# Altium project SIM_V2.PrjPCB
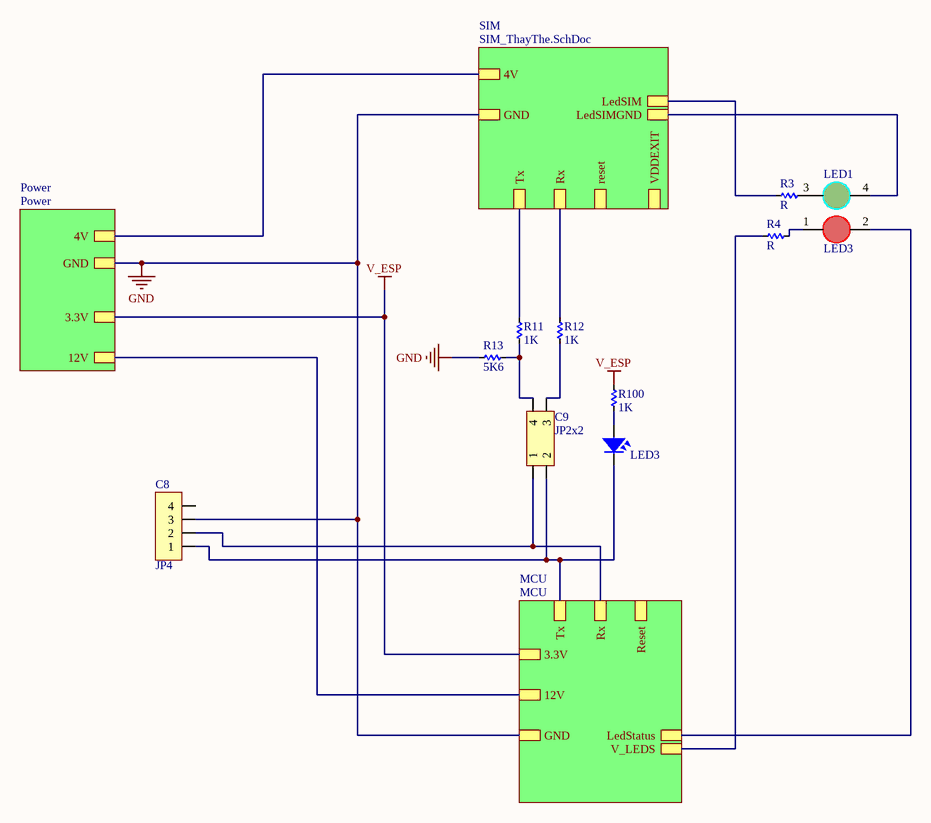
[diagram p0: Sheet1.SchDoc]
4 sheets, 64 parts. Net scope: hierarchical (ports join the sheet entries above them; power ports are global).
Board file: SIm800C-V2.PcbDoc
Sheets:
  Sheet1.SchDoc
    Power = Power.SchDoc
    SIM = SIM_ThayThe.SchDoc
    MCU = MCU.SchDoc

## Sheet Sheet1.SchDoc
size A

### Parts
C8  JP4  [JP4-C1T]
C9  JP2x2  [JP2-D2T]
LED1  LED3  [LedC]
LED3  LED  [LED-3MM-GREEN]  (value not drawn)
R3  R  [RES-SMD-0603_BIG]
R4  R  [RES-SMD-0603_BIG]
R11  1K  [RES-SMD-0805]
R12  1K  [RES-SMD-0805]
R13  5K6  [RES-SMD-0805]
R100  1K  [RES-SMD-0805]

### Sub-sheets
MCU = MCU: 3.3V, GND, Tx, Rx, Reset, 12V, LedStatus, V_LEDS
Power = Power: 4V, GND, 3.3V, 12V
SIM = SIM_ThayThe.SchDoc: 4V, GND, Tx, Rx, reset, VDDEXIT, LedSIM, LedSIMGND

### Nets
GND: C8.3 R13.2 ; sheet Power/GND, sheet SIM/GND, sheet MCU/GND
SGND: LED1.4(K) ; sheet SIM/LedSIMGND
V_ESP: R100.2 ; sheet Power/3.3V, sheet MCU/3.3V
NetC1_1: sheet Power/12V, sheet MCU/12V
NetC7_2: sheet Power/4V, sheet SIM/4V
NetC8_1: C8.1 C9.2 LED3.2 ; sheet MCU/Tx
NetC8_2: C8.2 C9.1 ; sheet MCU/Rx
NetC9_3: C9.3 R12.2
NetC9_4: C9.4 R11.2 R13.1
NetCx6_2: R4.2 ; sheet MCU/V_LEDS
NetESP1_12: LED1.2(K) ; sheet MCU/LedStatus
NetLED1_1: LED1.1(A) R4.1
NetLED1_3: LED1.3(A) R3.1
NetLED3_1: LED3.1 R100.1
NetR3_2: R3.2 ; sheet SIM/LedSIM
NetR11_1: R11.1 ; sheet SIM/Tx
NetR12_1: R12.1 ; sheet SIM/Rx

Not connected (* = marked no-connect by the designer): C8 4

### Library data of the parts
C8 = JP4: WR-PHD 2.54 mm Angled Socket Header; Manufacturer: W¨¹rth Elektronik eiSos GmbH; partNo: 613004143121; ComponentLink1 Description: Manufacturer; ComponentLink2 Description: Datasheet; NoPins: 04; Created Date: 29 March 2013; ComponentLink1URL: http://www.we-online.com; ComponentLink2URL: http://katalog.we-online.de/em/datasheet/6130xx143121.pdf; Created by: Karrer Zheng
C9 = JP2x2: WR-PHD 2.54 mm Dual Socket Header; Manufacturer: W¨¹rth Elektronik eiSos GmbH; partNo: 61300421821; ComponentLink1 Description: Manufacturer; ComponentLink2 Description: Datasheet; NoPins: 04; Created Date: 29 March 2013; ComponentLink1URL: http://www.we-online.com; ComponentLink2URL: http://katalog.we-online.de/em/datasheet/6130xx21821.pdf; Created by: Karrer Zheng
LED1 = LED: LED 3mm
LED3 = LED: LED Single colour Green and Red; Value: LED 3 ly Single Colour
R11-R13 R100 = Res-SMD: Resistor; Manufacturer: Generic Components; Class: Passive; Published: 08/06/2000; Publisher: Altium Hobart Technology Centre

## Sheet Power.SchDoc
size A
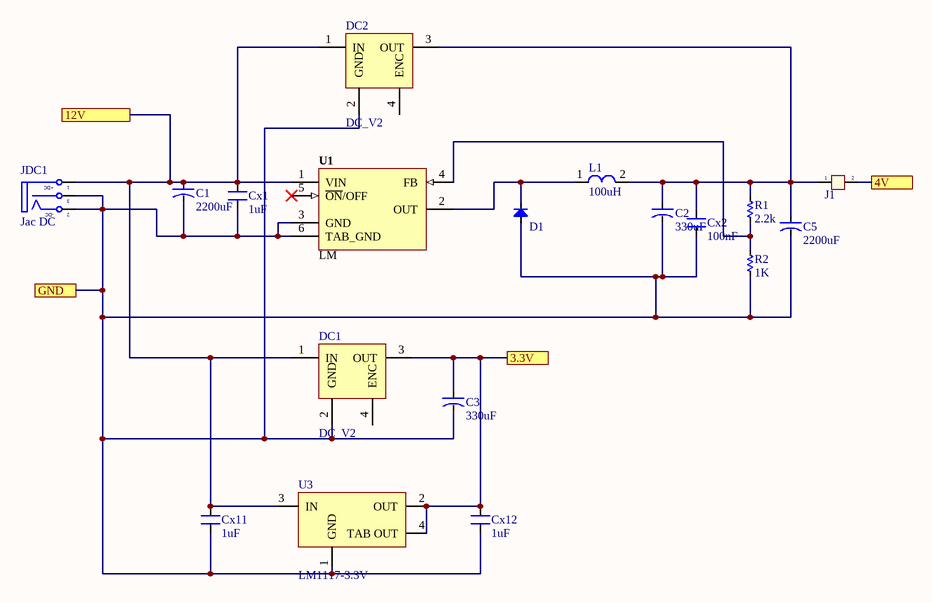
[diagram p1: Power.SchDoc]

### Parts
C1  2200uF  [CA-ALU-5]
C2  330uF  [CA-ALU-5]
C3  330uF  [CA-ALU-5]
C5  2200uF  [CA-ALU-5]
Cx1  1uF  [CN-SMD-0805]
Cx2  100nF  [CN-SMD-0805]
Cx11  1uF  [CN-SMD-0805]
Cx12  1uF  [CN-SMD-0805]
D1  MBR340  [DIO-5AN]  (value not drawn)
DC1  DC_V2  [DC_V2]
DC2  DC_V2  [DC_V2]
J1  Jumper 2  [JP2]  (value not drawn)
JDC1  Jac DC  [DC0]
L1  100uH  [L-SMD-M-12x10]
R1  2.2k  [RES-SMD-0805]
R2  1K  [RES-SMD-0805]
U1  LM  [TO263 - duplicate]
U3  LM1117-3.3V  [SOT223]

### Ports
3.3V, 4V, 12V, GND

### Nets
GND: C1.2 C2.2 C3.2 C5.2 Cx1.1 Cx2.1 Cx11.1 Cx12.1 D1.1(A) DC1.2(GND) DC2.2(GND) JDC1.2(TN) JDC1.3(S) R2.2 U1.3(GND) U1.6(TAB_GND) U3.1(GND) ; port GND
V_ESP: C3.1 Cx12.2 DC1.3(OUT) U3.2(OUT) U3.4(TAB_OUT) ; port 3.3V
NetC1_1: C1.1 Cx1.2 Cx11.2 DC1.1(IN) DC2.1(IN) JDC1.1(T) U1.1(VIN) U3.3(IN) ; port 12V
NetC2_1: C2.1 C5.1 Cx2.2 DC2.3(OUT) J1.1 L1.2 R1.1
NetC7_2: J1.2 ; port 4V
NetD1_2: D1.2(K) L1.1 U1.2(OUT)
NetR1_2: R1.2 R2.1 U1.4(FB)

Not connected (* = marked no-connect by the designer): DC1 4(ENC); DC2 4(ENC); U1 5(~{ON}/OFF)*

### Notes on the sheet
- (in symbol DCIN) +DC; -DC

### Library data of the parts
C1-C3 C5 = CN-ALU-DIP: Capacitor (Semiconductor SIM Model); Value: 104; LatestRevisionDate: 17-Jul-2002; LatestRevisionNote: Re-released for DXP Platform.; PackageReference: C1206; Publisher: Altium Limited
Cx1 Cx2 Cx11 Cx12 = CN: Value: 33pF
D1 = Diode: Default Diode; Code - JEDEC: DO-214-AB; Value: 1N5007; Published: 8-Jun-2000; Revision: July-2002: Re-released for DXP Platform.; Publisher: Altium Limited
DC1 DC2 = DC_Module_V2
J1 = JP 2: Value: JP 2
JDC1 = DCIN: Jac DC input; Value: Jac DC
L1 = L-SMD-1: partNo: 78477010; Manufacturer: Wurth Elektronik; Inductance: 1.0 μH; ComponentLink1Description: Manufacturer; ComponentLink1URL: http://www.we-online.de; Created by: Baojun Chen; Created Date: Nov.2015; ComponentLink2Description: Datasheet; ComponentLink2URL: http://katalog.we-online.de/pbs/datasheet/78477010.pdf
R1 R2 = Res-SMD: as R11 on sheet Sheet1; Published: 08/06/2000; Publisher: Altium Hobart Technology Centre
U1 = LM2596_1: Max Input Voltage: 12 V; Max Output Current: 3 (6.0 peak) A; Max Output Voltage: mV; Category: IC-Power; Min Input Voltage: mV; Min Output Voltage: mV; Mounting Technology: Surface Mount; Status: Unreleased; Supply Voltage: mV; Temperature Range: -40 to +125 degC
U3 = LM1117: 800mA Low-Dropout Linear Regulator; Creator: Nguyen Ba Bien; Website: http://group3i.net

## Sheet SIM_ThayThe.SchDoc
size A
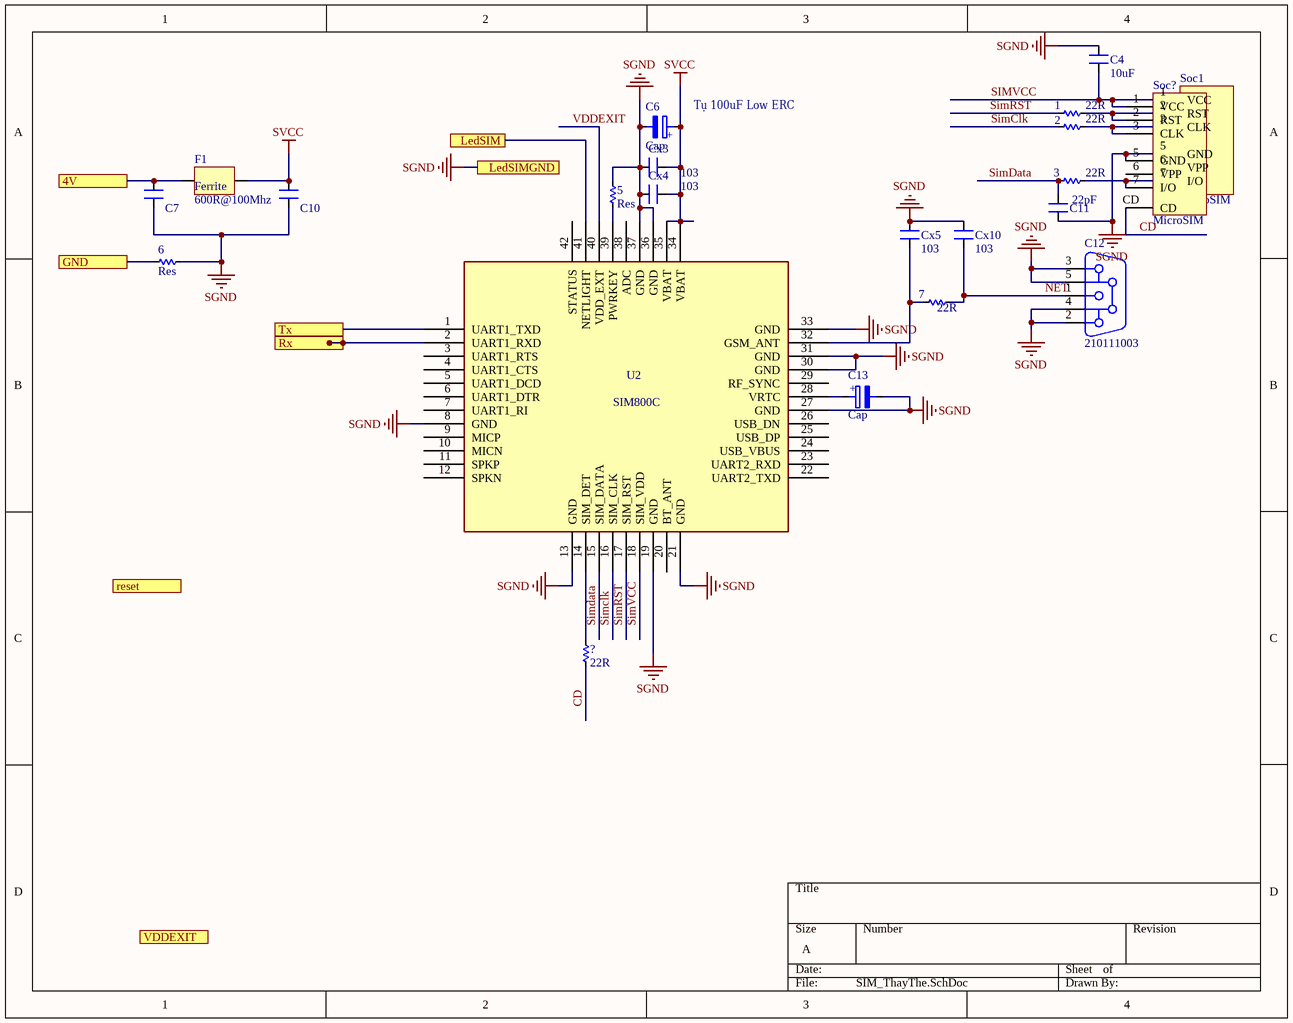
[diagram p2: SIM_ThayThe.SchDoc]

### Parts
1  22R  [RES-SMD-0603]
2  22R  [RES-SMD-0603]
3  22R  [RES-SMD-0603]
5  Res  [RES-SMD-1206]
6  Res  [RES-SMD-0805]
7  22R  [RES-SMD-0603]
?  22R  [RES-SMD-0603]
C4  10uF  [CN-SMD-0805]
C6  Cap  [Cap_C]
C7  CN  [CN-SMD-0805]  (value not drawn)
C10  CN  [CN-SMD-0805]  (value not drawn)
C11  22pF  [CN-SMD-0805]
C12  210111003  [SMA-RA]
C13  Cap  [Cap_C]
Cx3  103  [CN-SMD-1206]
Cx4  103  [CN-SMD-1206]
Cx5  103  [CN-SMD-1206]
Cx10  103  [CN-SMD-1206]
F1  600R@100Mhz  [Capacitor_805]
Soc1  MicroSIM  [microSIM]
Soc?  MicroSIM  [nanoSIM]
U2  SIM800C  [SIM800C]

### Ports
4V, GND, LedSIM, LedSIMGND, reset, Rx, Tx, VDDEXIT

### Nets
GND: 6.1 ; port GND
SGND: 5.1 6.2 C4.2 C6.2 C7.1 C10.1 C11.1 C12.2 C12.3 C12.4 C12.5 C13.2 Cx3.2 Cx4.2 Cx5.2 Cx10.2 Soc1.5(GND) Soc?.5(GND) U2.8(GND) U2.13(GND) U2.19(GND) U2.21(GND) U2.27(GND) U2.30(GND) U2.31(GND) U2.33(GND) U2.36(GND) U2.37(GND) ; port LedSIMGND
SVCC: C6.1 C10.2 Cx3.1 Cx4.1 F1.2 U2.34(VBAT) U2.35(VBAT)
CD: ?.1 Soc?.CD
NET: 7.2 C12.1 Cx10.1
SimClk: 2.1 U2.16(SIM_CLK)
SimData: 3.1 C11.2 U2.15(SIM_DATA)
SimRST: 1.1 U2.17(SIM_RST)
SIMVCC: C4.1 Soc1.1(VCC) Soc?.1(VCC) U2.18(SIM_VDD)
VDDEXIT: U2.40(VDD_EXT)
Net1_2: 1.2 Soc1.2(RST) Soc?.2(RST)
Net2_2: 2.2 Soc1.3(CLK) Soc?.3(CLK)
Net3_2: 3.2 Soc1.7(I/O) Soc?.7(I/O)
Net5_2: 5.2 U2.39(PWRKEY)
Net7_1: 7.1 Cx5.1 U2.32(GSM_ANT)
Net?_2: ?.2 U2.14(SIM_DET)
NetC7_2: C7.2 F1.1 ; port 4V
NetC13_1: C13.1 U2.28(VRTC)
NetR3_2: U2.41(NETLIGHT) ; port LedSIM
NetR11_1: U2.1(UART1_TXD) ; port Tx
NetR12_1: U2.2(UART1_RXD) ; port Rx

Not connected (* = marked no-connect by the designer): Soc1 6(VPP); Soc? 6(VPP); U2 3(UART1_RTS) 4(UART1_CTS) 5(UART1_DCD) 6(UART1_DTR) 7(UART1_RI) 9(MICP) 10(MICN) 11(SPKP) 12(SPKN) 20(BT_ANT) 22(UART2_TXD) 23(UART2_RXD) 24(USB_VBUS) 25(USB_DP) 26(USB_DN) 29(RF_SYNC) 38(ADC) 42(STATUS)

### Notes on the sheet
- (near C6) Tụ 100uF Low ERC
- (in symbol Cap_tan) +

### Library data of the parts
1-3 5-7 ? = Res-SMD: as R11 on sheet Sheet1; Published: 08/06/2000; Publisher: Altium Hobart Technology Centre
C4 C7 C10 C11 Cx3-Cx5 Cx10 = CN: Value: 33pF
C6 C13 = Cap_tan: Polarized Capacitor (Radial)
C12 = CON Ant: CONNECTOR ANTEN; Manufacturer: Würth Elektronik eiSos GmbH; partNo: 210111003; ComponentLink1Description: Manufacturer; ComponentLink1URL: http://www.we-online.de; Created by: Christin Zierenner; Created Date: May 2012; ComponentLink2Description: Datasheet; ComponentLink2URL: http://katalog.we-online.de/kataloge/eisos/index.php?language=en&pf=Filter_gerade
F1 = Ferrite
Soc1 = Soc_Micro_SIM
Soc? = SIM_Micro_SIM

## Sheet MCU.SchDoc
size A
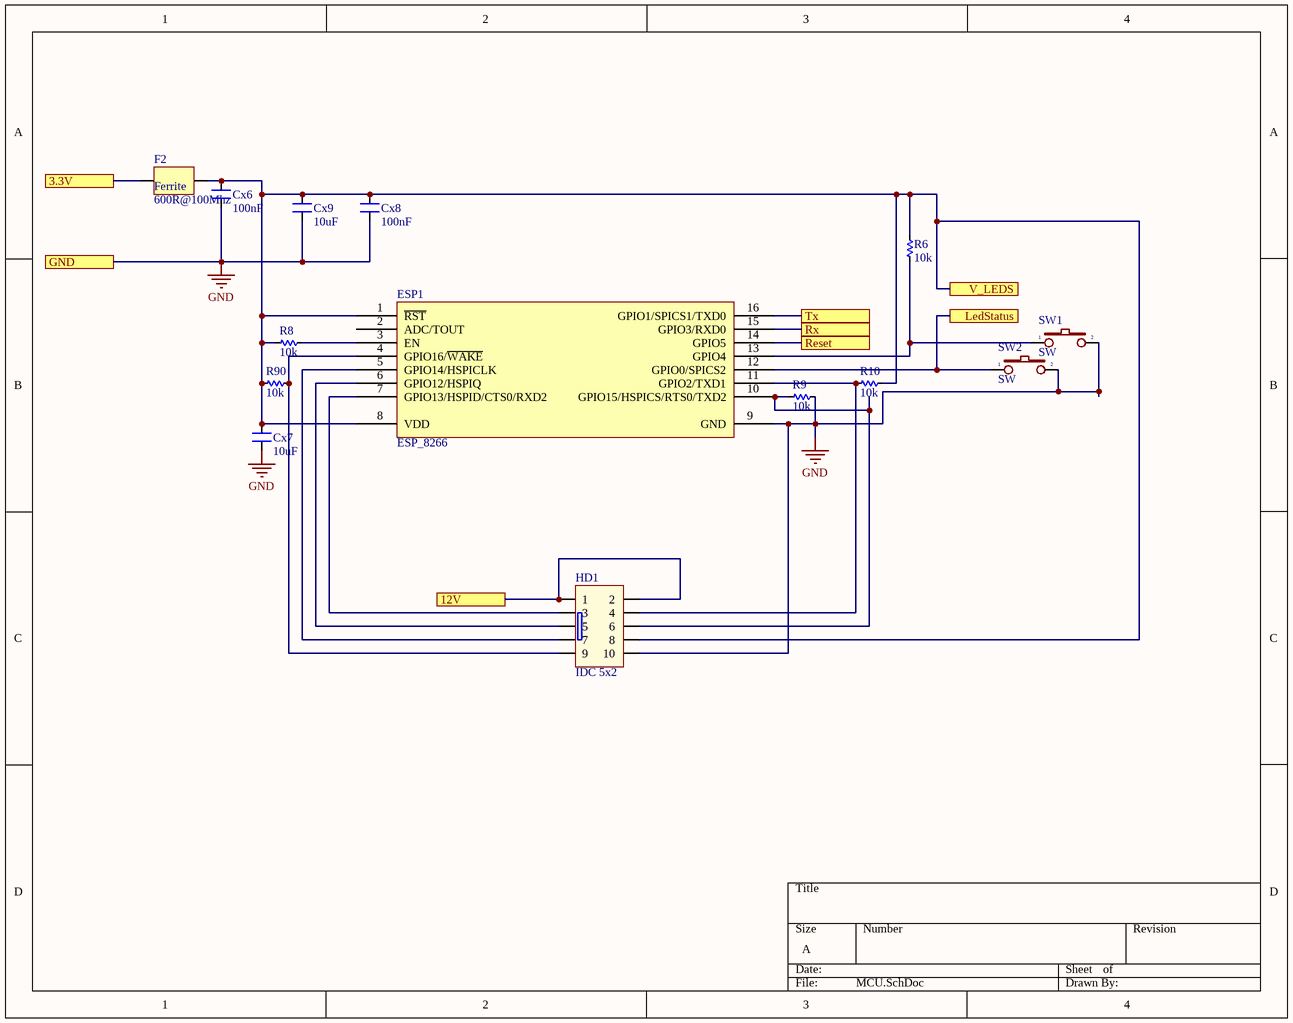
[diagram p3: MCU.SchDoc]

### Parts
Cx6  100nF  [CN-SMD-0805]
Cx7  10uF  [CN-SMD-0805]
Cx8  100nF  [CN-SMD-0805]
Cx9  10uF  [CN-SMD-0805]
ESP1  ESP_8266  [ESP12_small]
F2  600R@100Mhz  [Capacitor_805]
HD1  IDC 5x2  [IDC10-BH]
R6  10k  [RES-SMD-0805]
R8  10k  [RES-SMD-0805]
R9  10k  [RES-SMD-0805]
R10  10k  [RES-SMD-0805]
R90  10k  [RES-SMD-0805]
SW1  SW  [SW1-DIP]
SW2  SW  [SW1-SMD]

### Ports
3.3V, 12V, GND, LedStatus, Reset, Rx, Tx, V_LEDS

### Nets
GND: Cx6.1 Cx7.2 Cx8.1 Cx9.1 ESP1.9(GND) HD1.10 R9.1 SW1.2 SW2.2 ; port GND
V_ESP: F2.1 ; port 3.3V
NetC1_1: HD1.1 HD1.2 ; port 12V
NetC8_1: ESP1.16(GPIO1/SPICS1/TXD0) ; port Tx
NetC8_2: ESP1.15(GPIO3/RXD0) ; port Rx
NetCx6_2: Cx6.2 Cx7.1 Cx8.2 Cx9.2 ESP1.1(~{RST}) ESP1.8(VDD) F2.2 HD1.8 R6.1 R8.2 R10.1 R90.2 ; port V_LEDS
NetESP1_3: ESP1.3(EN) R8.1
NetESP1_4: ESP1.4(GPIO16/~{WAKE}) HD1.9 R90.1
NetESP1_5: ESP1.5(GPIO14/HSPICLK) HD1.7
NetESP1_6: ESP1.6(GPIO12/HSPIQ) HD1.5
NetESP1_7: ESP1.7(GPIO13/HSPID/CTS0/RXD2) HD1.3
NetESP1_10: ESP1.10(GPIO15/HSPICS/RTS0/TXD2) HD1.6 R9.2
NetESP1_11: ESP1.11(GPIO2/TXD1) HD1.4 R10.2
NetESP1_12: ESP1.12(GPIO0/SPICS2) SW2.1 ; port LedStatus
NetESP1_13: ESP1.13(GPIO4) R6.2 SW1.1
NetESP1_14: ESP1.14(GPIO5) ; port Reset

Not connected (* = marked no-connect by the designer): ESP1 2(ADC/TOUT)

### Library data of the parts
Cx6-Cx9 = CN: Value: 33pF
F2 = Ferrite
HD1 = IDC 5X2: Value: Header 5x2
R6 R8-R10 R90 = Res-SMD: as R11 on sheet Sheet1; Published: 08/06/2000; Publisher: Altium Hobart Technology Centre
SW1 SW2 = SW2: Switch button 2 pin; Value: SW chip 2 pin

## Nets that join several sheets
GND: Sheet1 (C8.3 R13.2), Power (17 pins), SIM_ThayThe (6.1), MCU (9 pins)
SGND: Sheet1 (LED1.4), SIM_ThayThe (28 pins)
V_ESP: Sheet1 (R100.2), Power (5 pins), MCU (F2.1)
NetC1_1: Power (8 pins), MCU (HD1.1 HD1.2)
NetC7_2: Power (J1.2), SIM_ThayThe (C7.2 F1.1)
NetC8_1: Sheet1 (C8.1 C9.2 LED3.2), MCU (ESP1.16)
NetC8_2: Sheet1 (C8.2 C9.1), MCU (ESP1.15)
NetCx6_2: Sheet1 (R4.2), MCU (12 pins)
NetESP1_12: Sheet1 (LED1.2), MCU (ESP1.12 SW2.1)
NetR3_2: Sheet1 (R3.2), SIM_ThayThe (U2.41)
NetR11_1: Sheet1 (R11.1), SIM_ThayThe (U2.1)
NetR12_1: Sheet1 (R12.1), SIM_ThayThe (U2.2)